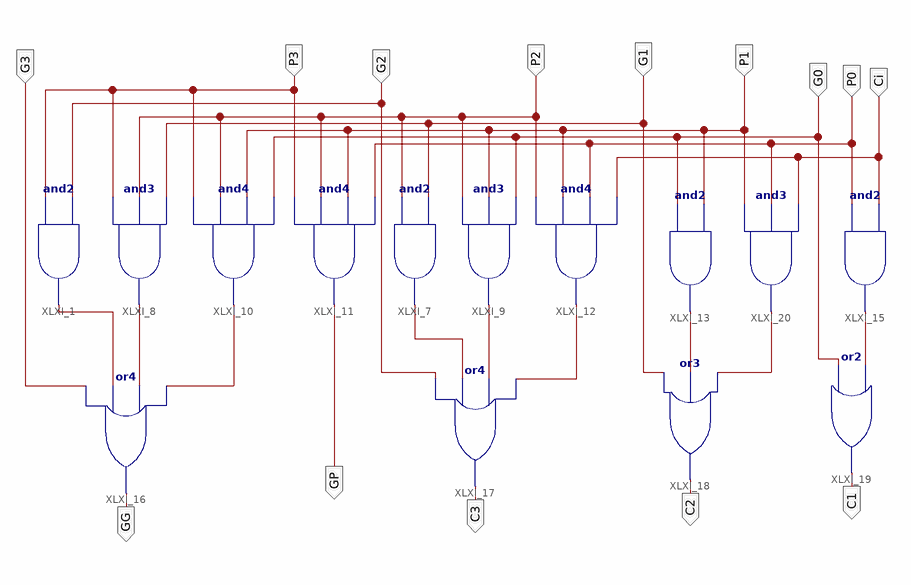
[diagram p0: schematic sheet 1]
// Xilinx ISE schematic CLA.sch (kintex7) as structural Verilog: 14 symbols, 14 ports
module CLA (
  input  G3,
  input  P3,
  input  G2,
  input  G1,
  input  G0,
  input  P0,
  input  Ci,
  input  P1,
  input  P2,
  output GG,
  output GP,
  output C3,
  output C2,
  output C1
);

  wire XLXN_1, XLXN_2, XLXN_3, XLXN_15, XLXN_19, XLXN_20, XLXN_21, XLXN_22, XLXN_24;

  and XLXI_1 (XLXN_1, P3, G2);
  and XLXI_7 (XLXN_20, P2, G1);
  and XLXI_9 (XLXN_15, P2, P1, G0);
  and XLXI_10 (XLXN_3, P3, P2, P1, G0);
  and XLXI_11 (GP, P3, P2, P1, P0);
  and XLXI_12 (XLXN_19, P2, P1, P0, Ci);
  and XLXI_13 (XLXN_21, G0, P1);
  and XLXI_15 (XLXN_24, P0, Ci);
  or XLXI_16 (GG, G3, XLXN_1, XLXN_2, XLXN_3);
  and XLXI_8 (XLXN_2, P3, P2, G1);
  or XLXI_17 (C3, G2, XLXN_20, XLXN_15, XLXN_19);
  or XLXI_18 (C2, G1, XLXN_21, XLXN_22);
  or XLXI_19 (C1, G0, XLXN_24);
  and XLXI_20 (XLXN_22, P1, P0, Ci);
endmodule
